# EAGLE schematic Controller Interface:Headers (EAGLE 6.5.0)
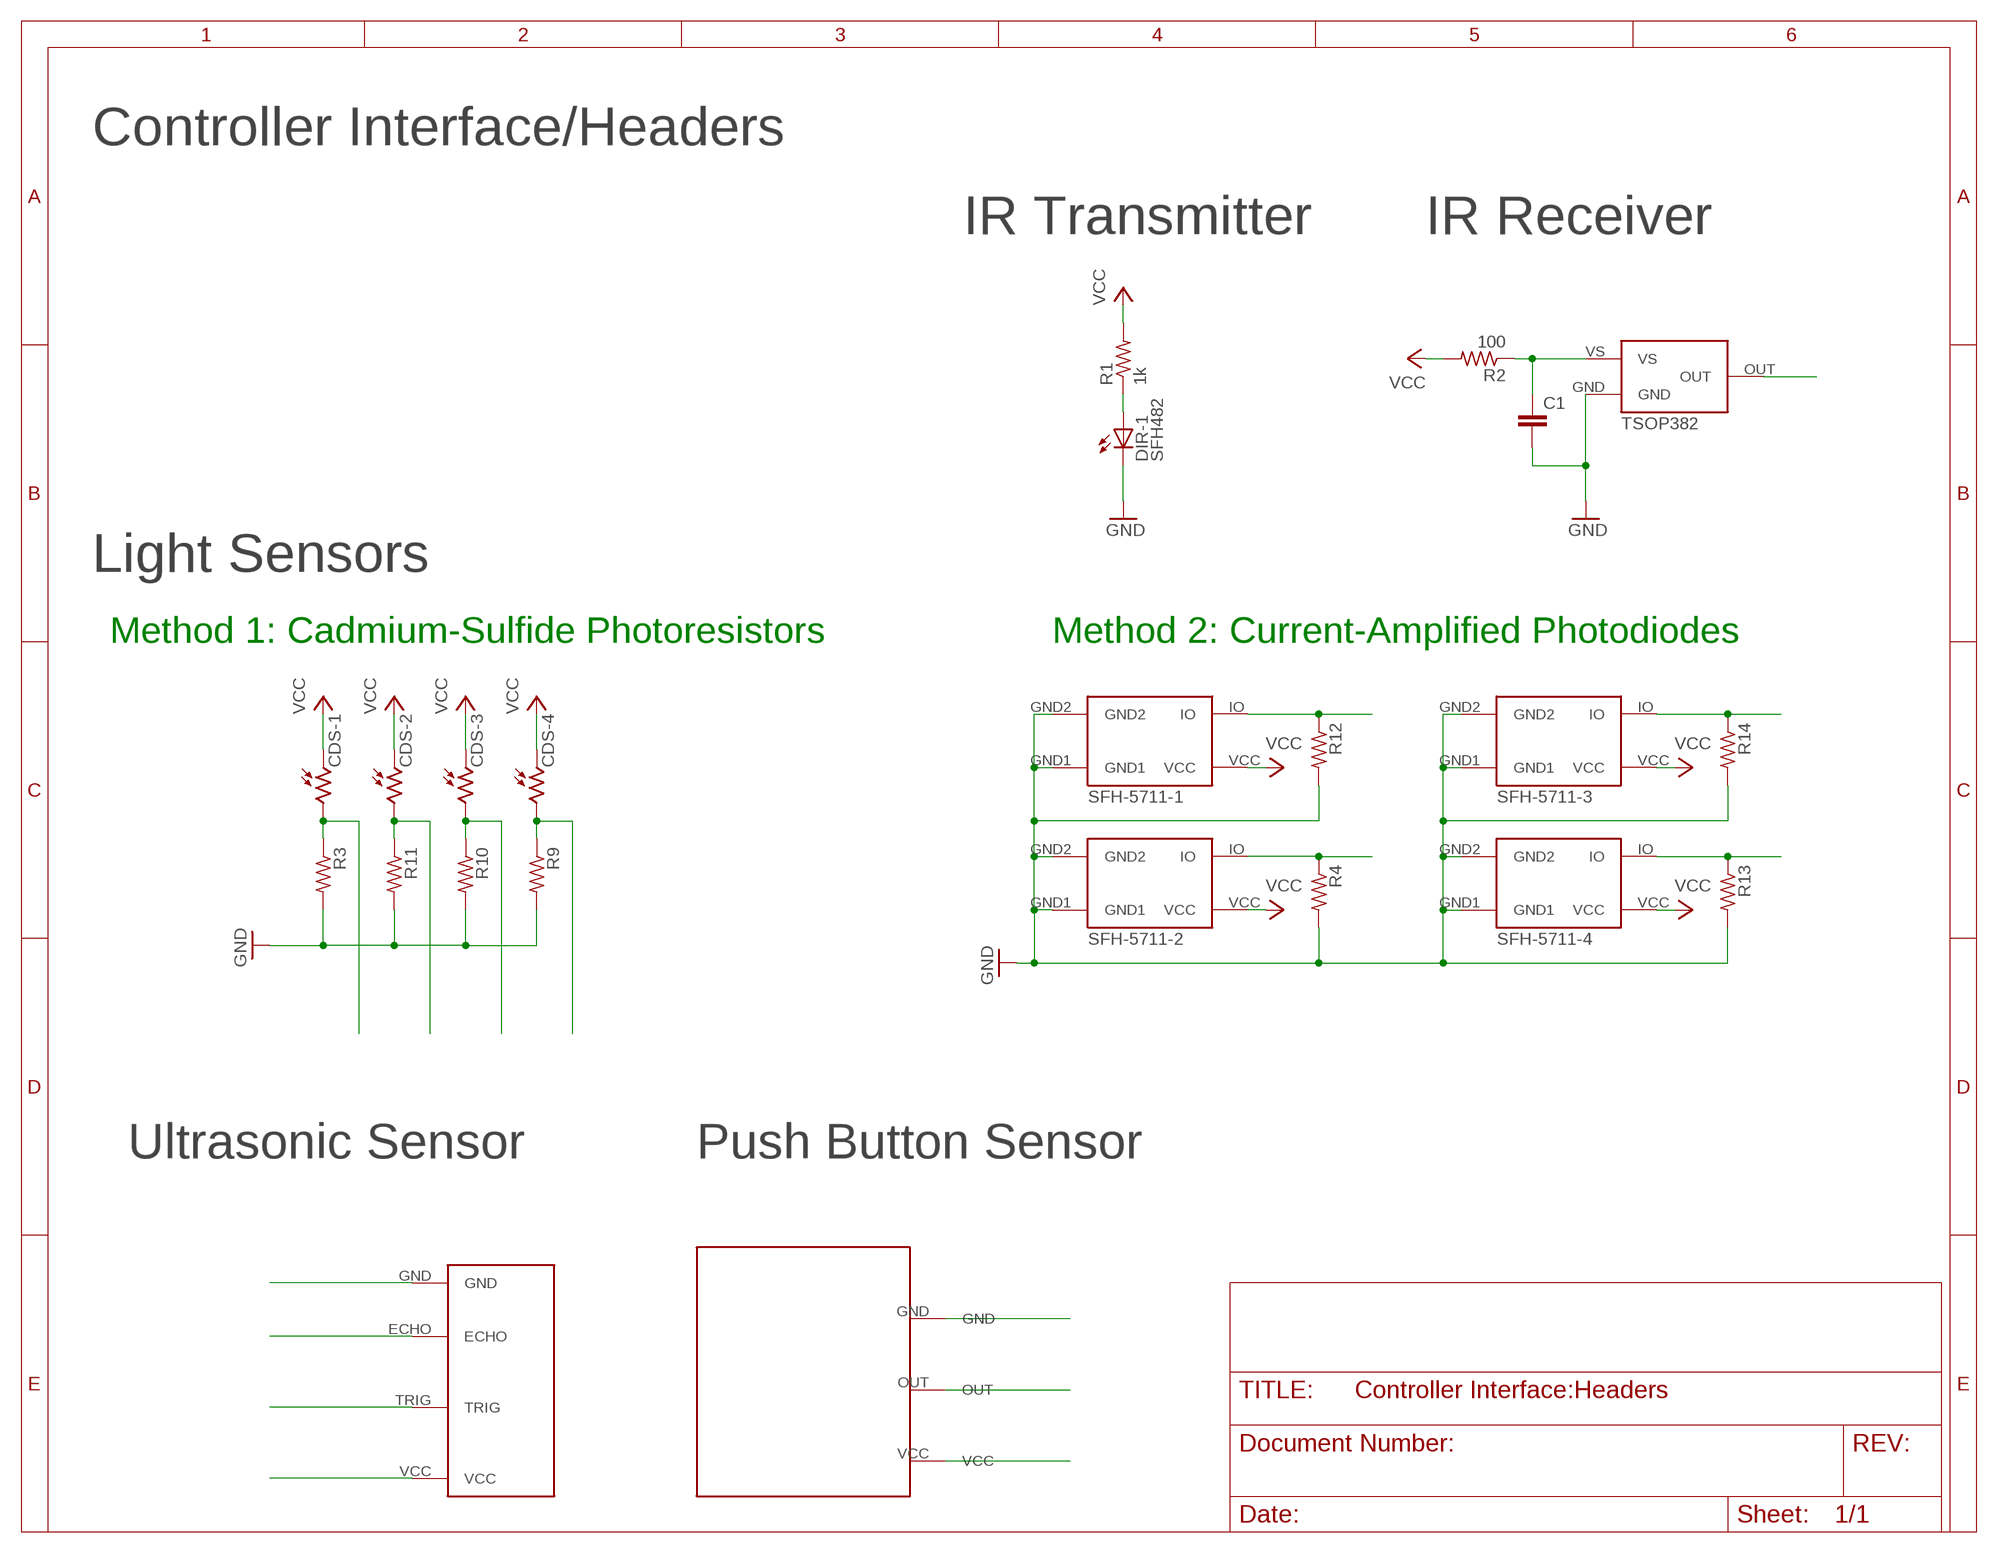
[diagram p0: schematic, sheet 1]

## Parts
C1  C2,5-3  [C2.5-3]
CDS-1  M9960_11A  [M9960]
CDS-2  M9960_11A  [M9960]
CDS-3  M9960_11A  [M9960]
CDS-4  M9960_11A  [M9960]
DIR-1  SFH482  [SFH482]
R1  1k  R-US_0204/2V  [0204V]
R2  100  R-US_0204/2V  [0204V]
R3  R-US_0204/2V  [0204V]
R4  R-US_0204/2V  [0204V]
R9  R-US_0204/2V  [0204V]
R10  R-US_0204/2V  [0204V]
R11  R-US_0204/2V  [0204V]
R12  R-US_0204/2V  [0204V]
R13  R-US_0204/2V  [0204V]
R14  R-US_0204/2V  [0204V]
TSOP382  TSOP382  [IR-REC]
U$1  SFH5711  [DIODE]
U$2  SFH5711  [DIODE]
U$3  SFH5711  [DIODE]
U$4  SFH5711  [DIODE]
U$5  ULTRASONIC  [ULTRASONIC]
U$6  PUSHBUTTON  [BUTTON]

## Nets
DIR-1: DIR-1.K(C) ; supply symbol labelled GND
GND: C1.2 R3.2 R4.2 R9.2 R10.2 R11.2 R12.2 R13.2 R14.2 TSOP382.GND U$1.GND1 U$1.GND2 U$2.GND1 U$2.GND2 U$3.GND1 U$3.GND2 U$4.GND1 U$4.GND2
N$1: DIR-1.A R1.1
N$2: CDS-1.2 R3.1
N$3: C1.1 R2.1 TSOP382.VS
N$4: CDS-4.2 R9.1
N$5: U$5.GND
N$6: U$5.ECHO
N$7: U$5.TRIG
N$8: U$5.VCC
N$11: CDS-3.2 R10.1
N$13: CDS-2.2 R11.1
N$14: R12.1 U$2.IO
N$15: R4.1 U$1.IO
N$16: TSOP382.OUT
N$17: R14.1 U$3.IO
N$19: R13.1 U$4.IO
VCC: CDS-1.1 CDS-2.1 CDS-3.1 CDS-4.1 R1.2 R2.2 U$1.VCC U$2.VCC U$3.VCC U$4.VCC
Unconnected: U$6.GND U$6.OUT U$6.VCC

## Notes on the sheet
- Controller Interface/Headers
- IR Transmitter | IR Receiver
- TSOP382
- Light Sensors
- Method 1: Cadmium-Sulfide Photoresistors | Method 2: Current-Amplified Photodiodes
- SFH-5711-1 | SFH-5711-3
- SFH-5711-2 | SFH-5711-4
- Ultrasonic Sensor | Push Button Sensor

## Library data of the parts
C1 = capacitor-wima:C: CAPACITOR naming: grid - package width
CDS-1-CDS-4 = photo-elements:M9960_11: Photo Sensor Beacon Light, Photometer Applications Source: http://optoelectronics.perkinelmer.com/content/Datasheets/DTS_M9960.pdf
DIR-1 = led:SFH482: IR LED infrared emitting diode, Infineon
R1-R4 R9-R14 = resistor:R-US_: RESISTOR, American symbol
TSOP382 = JDT-18:TSOP382
U$1-U$4 = JDT-18:SFH5711: SFH 5711 - Photodiode with Built-In Current Amplifier
U$5 = JDT_18:ULTRASONIC
U$6 = JDT_18_2:PUSHBUTTON